# EAGLE schematic so_serial (EAGLE 6.0)
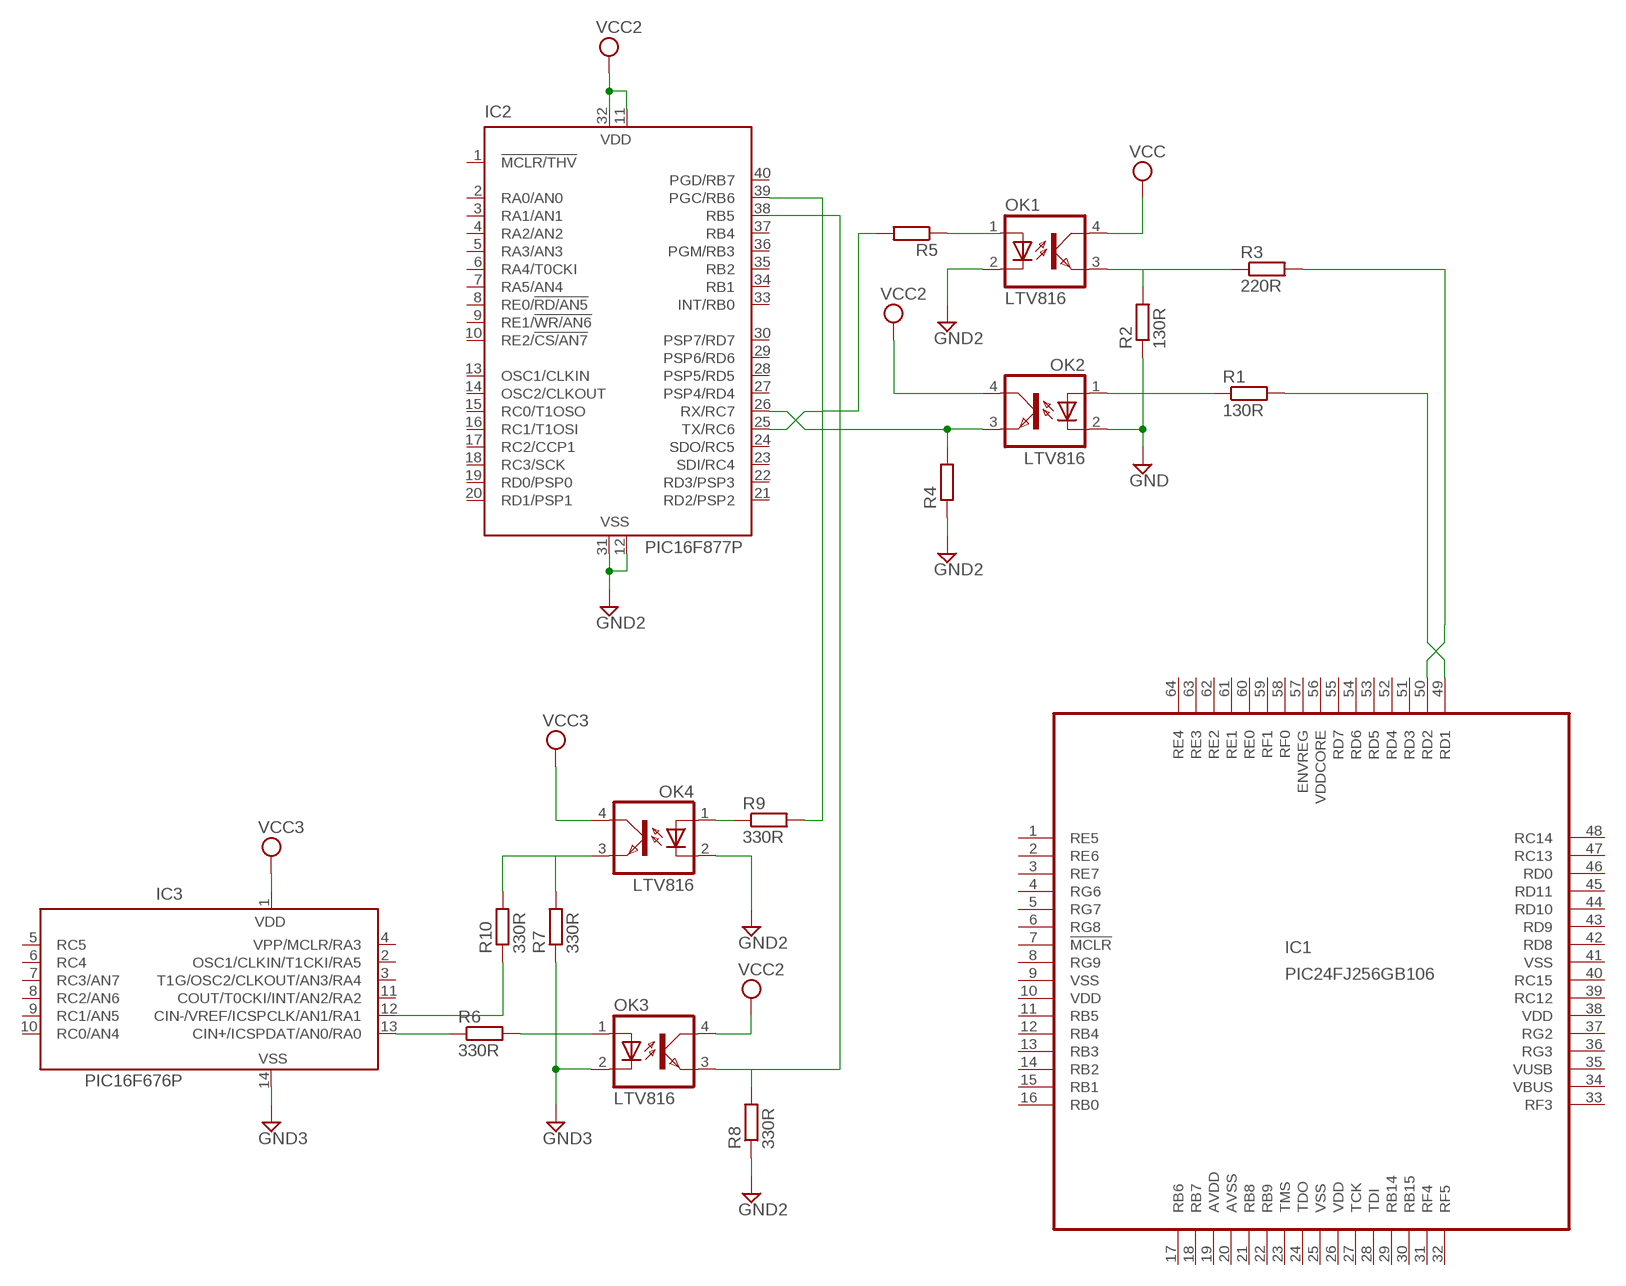
[diagram p0: schematic, sheet 1]

## Parts
IC1  PIC24FJ256GB106  [TQFP64-10X10]
IC2  PIC16F877P  [DIL40]
IC3  PIC16F676P  [DIL14]
OK1  LTV816  [DIL04]
OK2  LTV816  [DIL04]
OK3  LTV816  [DIL04]
OK4  LTV816  [DIL04]
R1  130R  R-EU_0204/2V  [0204V]
R2  130R  R-EU_0204/2V  [0204V]
R3  220R  R-EU_0204/2V  [0204V]
R4  R-EU_0204/2V  [0204V]
R5  R-EU_0204/2V  [0204V]
R6  330R  R-EU_0204/2V  [0204V]
R7  330R  R-EU_0204/2V  [0204V]
R8  330R  R-EU_0204/2V  [0204V]
R9  330R  R-EU_0204/2V  [0204V]
R10  330R  R-EU_0204/2V  [0204V]

## Nets
GND: IC2.12(VSS) IC2.31(VSS) IC3.14(VSS) OK1.2(C) OK2.2(C) OK3.2(C) OK4.2(C) R2.1 R4.1 R7.1 R8.1 ; supply symbol labelled GND2, GND3
N$1: R3.2
N$2: OK2.1(A) R1.1
N$4: OK1.3(EMIT) R2.2 R3.1
N$5: IC1.49(RD1) R1.2
N$6: R5.1
N$7: R5.2
N$8: IC2.26(RX/RC7) OK2.3(EMIT) R4.2
N$9: IC2.25(TX/RC6)
N$10: IC1.50(RD2)
N$11: IC2.39(PGC/RB6) R9.2
N$12: IC3.13(CIN+/ICSPDAT/AN0/RA0) R6.1
N$13: OK3.1(A) R6.2
N$14: OK4.3(EMIT) R7.2 R10.2
N$15: IC2.38(RB5) OK3.3(EMIT) R8.2
N$16: OK4.1(A) R9.1
N$17: IC3.12(CIN-/VREF/ICSPCLK/AN1/RA1) R10.1
VCC: IC2.11(VDD) IC2.32(VDD) IC3.1(VDD) OK1.4(COL) OK2.4(COL) OK3.4(COL) OK4.4(COL) ; supply symbol labelled VCC2, VCC3
Unconnected: IC1.1(RE5) IC1.2(RE6) IC1.3(RE7) IC1.4(RG6) IC1.5(RG7) IC1.6(RG8) IC1.7(!MCLR) IC1.8(RG9) IC1.11(RB5) IC1.12(RB4) IC1.13(RB3) IC1.14(RB2) IC1.15(RB1) IC1.16(RB0) IC1.17(RB6) IC1.18(RB7) IC1.21(RB8) IC1.22(RB9) IC1.23(TMS) IC1.24(TDO) IC1.27(TCK) IC1.28(TDI) IC1.29(RB14) IC1.30(RB15) IC1.31(RF4) IC1.32(RF5) IC1.33(RF3) IC1.34(VBUS) IC1.35(VUSB) IC1.36(RG3) IC1.37(RG2) IC1.39(RC12) IC1.40(RC15) IC1.42(RD8) IC1.43(RD9) IC1.44(RD10) IC1.45(RD11) IC1.46(RD0) IC1.47(RC13) IC1.48(RC14) IC1.51(RD3) IC1.52(RD4) IC1.53(RD5) IC1.54(RD6) IC1.55(RD7) IC1.57(ENVREG) IC1.58(RF0) IC1.59(RF1) IC1.60(RE0) IC1.61(RE1) IC1.62(RE2) IC1.63(RE3) IC1.64(RE4) IC2.1(!MCLR/THV) IC2.2(RA0/AN0) IC2.3(RA1/AN1) IC2.4(RA2/AN2) IC2.5(RA3/AN3) IC2.6(RA4/T0CKI) IC2.7(RA5/AN4) IC2.8(RE0/!RD/AN5) IC2.9(RE1/!WR/AN6) IC2.10(RE2/!CS/AN7) IC2.13(OSC1/CLKIN) IC2.14(OSC2/CLKOUT) IC2.15(RC0/T1OSO) IC2.16(RC1/T1OSI) IC2.17(RC2/CCP1) IC2.18(RC3/SCK) IC2.19(RD0/PSP0) IC2.20(RD1/PSP1) IC2.21(RD2/PSP2) IC2.22(RD3/PSP3) IC2.23(SDI/RC4) IC2.24(SDO/RC5) IC2.27(PSP4/RD4) IC2.28(PSP5/RD5) IC2.29(PSP6/RD6) IC2.30(PSP7/RD7) IC2.33(INT/RB0) IC2.34(RB1) IC2.35(RB2) IC2.36(PGM/RB3) IC2.37(RB4) IC2.40(PGD/RB7) IC3.2(OSC1/CLKIN/T1CKI/RA5) IC3.3(T1G/OSC2/CLKOUT/AN3/RA4) IC3.4(VPP/MCLR/RA3) IC3.5(RC5) IC3.6(RC4) IC3.7(RC3/AN7) IC3.8(RC2/AN6) IC3.9(RC1/AN5) IC3.10(RC0/AN4) IC3.11(COUT/T0CKI/INT/AN2/RA2) OK1.1(A)

## Power pins joined to a net without a drawn wire
AVDD: IC1.19(AVDD)
AVSS: IC1.20(AVSS)
VDD: IC1.10(VDD) IC1.26(VDD) IC1.38(VDD)
VDDCORE: IC1.56(VDDCORE)
VSS: IC1.9(VSS) IC1.25(VSS) IC1.41(VSS)

## Library data of the parts
IC1 = microchip:PIC24FJ256GB106: PIC24FJ256GB106 edit this description Auto generated by make-symbol-device-package-bsdl.ulp Rev. 25 Source: PIC24FJ256GB106.bsd; MPN: PIC24FJ256GB106-I/PT; OC_FARNELL: 1576868; OC_NEWARK: 54M5129
IC2 = microchip:PIC16F87*: MICROCONTROLLER; MF: MICROCHIP; MPN: PIC16F877-04/P; OC_FARNELL: 9761349; OC_NEWARK: 61K3463
IC3 = microchip:PIC16F676: 14-Pin, Flash-Based 8-Bit CMOS Microcontroller High Performance RISC CPU: * Only 35 instructions to learn - All single-cycle instructions except branches * Operating speed: - DC - 20 MHz oscillator/clock input - DC - 200 ns instruction cycle * Internal and external oscillator options - Precision Internal 4 MHz oscillator factory calibrated to ±1% - External Oscillator support for crystals and resonators - 5?s wake-up from SLEEP, 3.0V, typical * Power saving SLEEP mode * Wide operating voltage range - 2.0V to 5.5V * Industrial and Extended temperature range * Low power Power-on Reset (POR) * Power-up Timer (PWRT) and Oscillator Start-up Timer (OST) * Brown-out Detect (BOD) * Watchdog Timer (WDT) with independent oscillator for reliable operation * Multiplexed MCLR/Input-pin * Interrupt-on-pin change * Individual programmable weak pull-ups * Programmable code protection * High Endurance FLASH/EEPROM Cell - 100,000 write FLASH endurance - 1,000,000 write EEPROM endurance - FLASH/Data EEPROM Retention: > 40 years * Standby Current: - 1 nA @ 2.0V, typical * Operating Current: - 8.5?A @ 32 kHz, 2.0V, typical - 100?A @ 1 MHz, 2.0V, typical * Watchdog Timer Current - 300 nA @ 2.0V, typical * Timer1 oscillator current: - 4?A @ 32 kHz, 2.0V, typical * 12 I/O pins with individual direction control * High current sink/source for direct LED drive * Analog-to-Digital Converter module (PIC16F676): - 10-bit resolution - Programmable 8-channel input - Voltage reference input * In-Circuit Serial ProgrammingTM (ICSPTM) via two pins Source: http://ww1.microchip.com/downloads/en/DeviceDoc/40039E.pdf; MF: MICROCHIP; MPN: PIC16F676-I/P; OC_FARNELL: 9760512; OC_NEWARK: 54K2829
OK1-OK4 = optocoupler:LTV816: OPTO COUPLER Source: LITEON, LTV816.pdf; OC_FARNELL: unknown; OC_NEWARK: unknown
R1-R10 = rcl:R-EU_: RESISTOR, European symbol